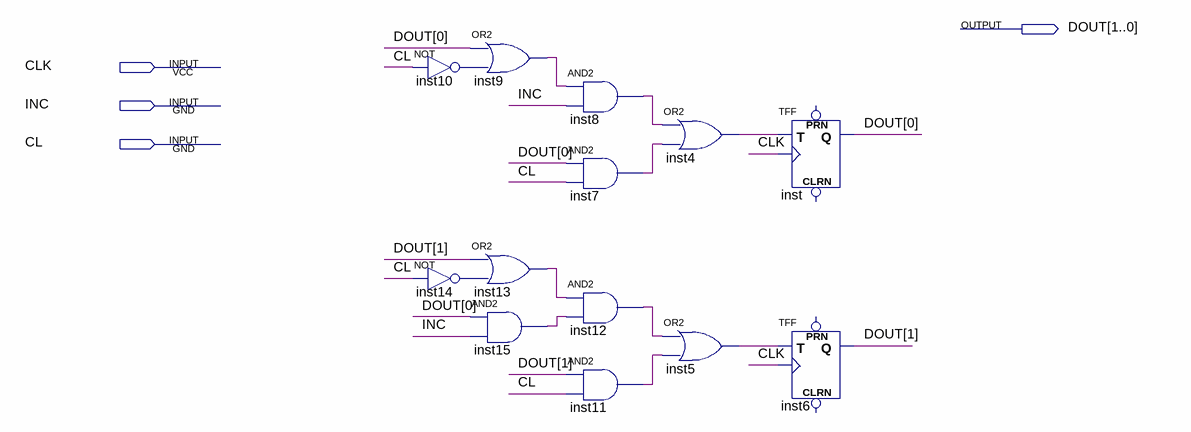
[diagram p0: schematic sheet]
// Quartus schematic REG2_INC_CL.bdf as structural Verilog: 13 symbols, 4 pins
module REG2_INC_CL (
  input  CLK,
  input  INC,
  input  CL,
  output [1:0] DOUT
);

  wire inst4_out, inst5_out, inst7_out, inst8_out, inst9_out, inst10_out, inst11_out, inst12_out, inst13_out,
       inst14_out, inst15_out;

  not inst10 (inst10_out, CL);
  not inst14 (inst14_out, CL);
  or inst9 (inst9_out, DOUT[0], inst10_out);
  or inst13 (inst13_out, DOUT[1], inst14_out);
  and inst15 (inst15_out, DOUT[0], INC);
  and inst8 (inst8_out, inst9_out, INC);
  and inst7 (inst7_out, DOUT[0], CL);
  and inst12 (inst12_out, inst13_out, inst15_out);
  and inst11 (inst11_out, DOUT[1], CL);
  or inst4 (inst4_out, inst8_out, inst7_out);
  or inst5 (inst5_out, inst12_out, inst11_out);
  TFF inst (.T(inst4_out), .CLK(CLK), .Q(DOUT[0]));  // open: PRN, CLRN
  TFF inst6 (.T(inst5_out), .CLK(CLK), .Q(DOUT[1]));  // open: PRN, CLRN
endmodule
